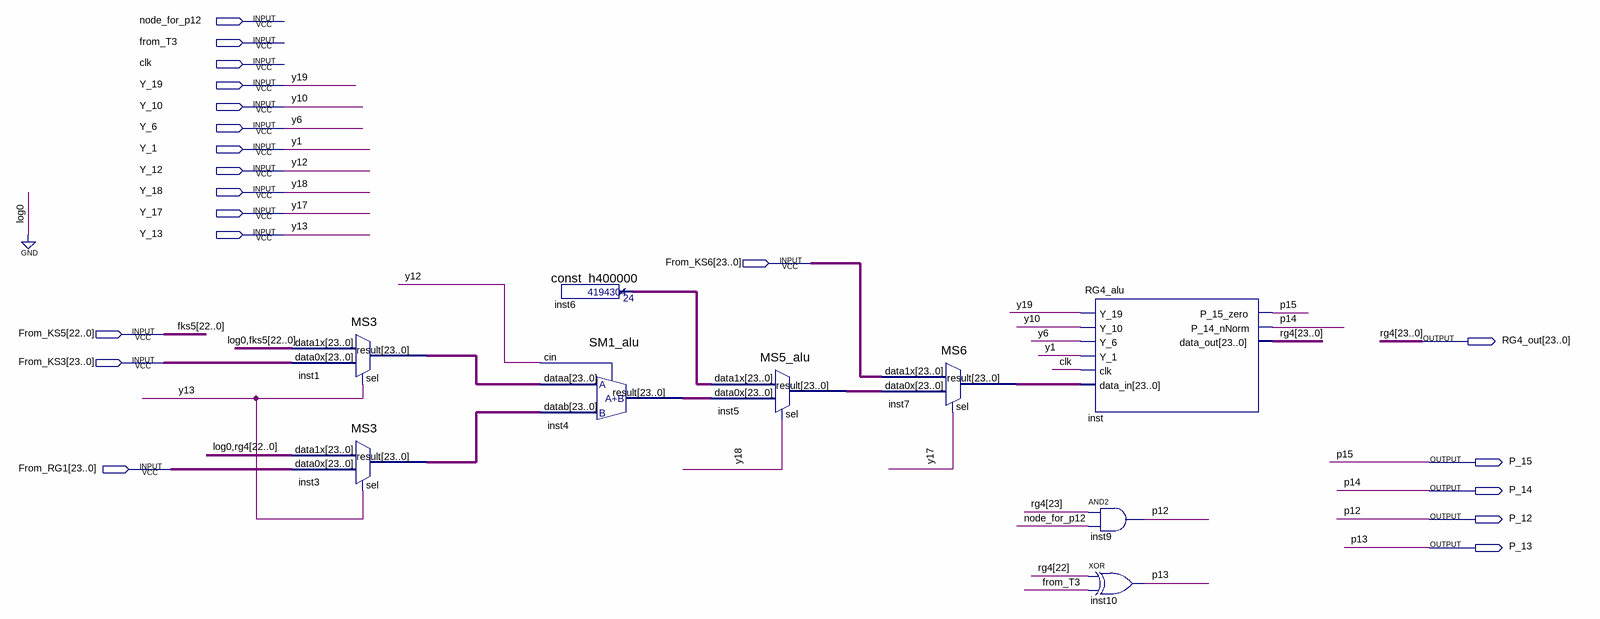
[diagram p0: schematic sheet]
// Quartus schematic CASCADE_RG4_block.bdf as structural Verilog: 9 symbols, 20 pins
module CASCADE_RG4_block (
  input  node_for_p12,
  input  from_T3,
  input  clk,
  input  Y_19,
  input  Y_10,
  input  Y_6,
  input  Y_1,
  input  Y_12,
  input  Y_18,
  input  Y_17,
  input  Y_13,
  input  [23:0] From_KS6,
  input  [22:0] From_KS5,
  input  [23:0] From_KS3,
  input  [23:0] From_RG1,
  output [23:0] RG4_out,
  output P_15,
  output P_14,
  output P_12,
  output P_13
);

  wire [23:0] inst1_result, inst3_result, inst4_result, inst5_result, inst6_result, inst7_result;

  MS3 inst1 (.data1x({1'b0, From_KS5}), .data0x(From_KS3), .sel(Y_13), .result(inst1_result));
  MS3 inst3 (.data1x({1'b0, RG4_out[22:0]}), .data0x(From_RG1), .sel(Y_13), .result(inst3_result));
  const_h400000 inst6 (.result(inst6_result));
  SM1_alu inst4 (.dataa(inst1_result), .datab(inst3_result), .cin(Y_12), .result(inst4_result));
  MS5_alu inst5 (.data1x(inst6_result), .data0x(inst4_result), .sel(Y_18), .result(inst5_result));
  MS6 inst7 (.data1x(From_KS6), .data0x(inst5_result), .sel(Y_17), .result(inst7_result));
  RG4_alu inst (
    .Y_19(Y_19), .Y_10(Y_10), .Y_6(Y_6), .Y_1(Y_1), .clk(clk), .data_in(inst7_result), .P_15_zero(P_15),
    .P_14_nNorm(P_14), .data_out(RG4_out));
  and inst9 (P_12, RG4_out[23], node_for_p12);
  xor inst10 (P_13, RG4_out[22], from_T3);

  // Other names for the same wires on the sheet: fks5[22:0] = From_KS5; p12 = P_12; p13 = P_13; p14 = P_14;
  //   p15 = P_15; rg4[23:0] = RG4_out; y1 = Y_1; y6 = Y_6; y10 = Y_10; y12 = Y_12; y13 = Y_13; y17 = Y_17; y18 = Y_18;
  //   y19 = Y_19
endmodule
